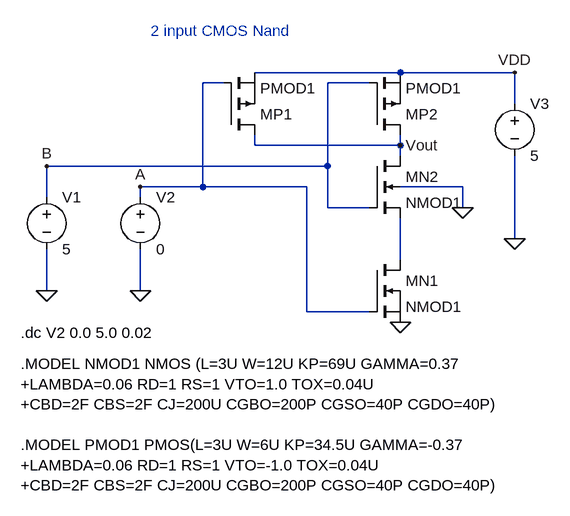
[diagram p0: schematic two_in_cmos_nand.asc]
two_in_cmos_nand.asc, the LTspice schematic file:
Version 4
SHEET 1 880 680
WIRE 416 -96 192 -96
WIRE 592 -96 416 -96
WIRE 144 -80 112 -80
WIRE 368 -80 304 -80
WIRE 592 -48 592 -96
WIRE 192 16 192 0
WIRE 416 16 416 0
WIRE 416 16 192 16
WIRE 416 32 416 16
WIRE 304 48 304 -80
WIRE 304 48 -128 48
WIRE 112 80 112 -80
WIRE 112 80 16 80
WIRE 272 80 112 80
WIRE 512 80 416 80
WIRE -128 96 -128 48
WIRE 16 96 16 80
WIRE 304 112 304 48
WIRE 368 112 304 112
WIRE 512 112 512 80
WIRE 592 160 592 32
WIRE 416 192 416 128
WIRE -128 240 -128 176
WIRE 16 240 16 176
WIRE 272 272 272 80
WIRE 368 272 272 272
FLAG -128 240 0
FLAG 16 240 0
FLAG 416 288 0
FLAG 592 160 0
FLAG 512 112 0
FLAG -128 48 B
FLAG 16 80 A
FLAG 592 -96 VDD
FLAG 416 16 Vout
SYMBOL voltage -128 80 R0
SYMATTR InstName V1
SYMATTR Value 5
SYMBOL voltage 16 80 R0
SYMATTR InstName V2
SYMATTR Value 0
SYMBOL voltage 592 -64 R0
SYMATTR InstName V3
SYMATTR Value 5
SYMBOL nmos 368 192 R0
SYMATTR InstName MN1
SYMATTR Value NMOD1
SYMBOL nmos4 368 32 R0
SYMATTR InstName MN2
SYMATTR Value NMOD1
SYMBOL pmos 368 0 M180
SYMATTR InstName MP2
SYMATTR Value PMOD1
SYMBOL pmos 144 0 M180
SYMATTR InstName MP1
SYMATTR Value PMOD1
TEXT 32 -160 Left 2 ;2 input CMOS Nand
TEXT -168 352 Left 2 !.MODEL NMOD1 NMOS (L=3U W=12U KP=69U GAMMA=0.37\n+LAMBDA=0.06 RD=1 RS=1 VTO=1.0 TOX=0.04U\n+CBD=2F CBS=2F CJ=200U CGBO=200P CGSO=40P CGDO=40P)\n \n.MODEL PMOD1 PMOS(L=3U W=6U KP=34.5U GAMMA=-0.37\n+LAMBDA=0.06 RD=1 RS=1 VTO=-1.0 TOX=0.04U\n+CBD=2F CBS=2F CJ=200U CGBO=200P CGSO=40P CGDO=40P)
TEXT -168 304 Left 2 !.dc V2 0.0 5.0 0.02

The netlist it stands for:
* two_in_cmos_nand.asc
V1 B 0 5
V2 A 0 0
V3 VDD 0 5
MN1 N001 A 0 0 NMOD1
MN2 Vout B N001 0 NMOD1
MP2 Vout B VDD VDD PMOD1
MP1 Vout A VDD VDD PMOD1
.model NMOS NMOS
.model PMOS PMOS
.lib standard.mos
* 2 input CMOS Nand
.MODEL NMOD1 NMOS (L=3U W=12U KP=69U GAMMA=0.37
+LAMBDA=0.06 RD=1 RS=1 VTO=1.0 TOX=0.04U
+CBD=2F CBS=2F CJ=200U CGBO=200P CGSO=40P CGDO=40P)
.MODEL PMOD1 PMOS(L=3U W=6U KP=34.5U GAMMA=-0.37
+LAMBDA=0.06 RD=1 RS=1 VTO=-1.0 TOX=0.04U
+CBD=2F CBS=2F CJ=200U CGBO=200P CGSO=40P CGDO=40P)
.dc V2 0.0 5.0 0.02
.backanno
.end

* Results of the author's LTspice run, read from the files saved beside the schematic
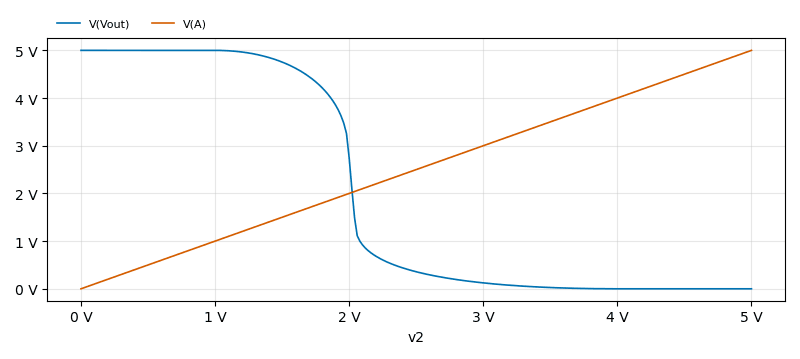
[diagram p1: DC transfer characteristic of two_in_cmos_nand.asc, plotted from the saved traces]
* DC transfer characteristic, 1 run:
*   V(Vout): 5 V at v2=0 V, 36.35 nV at v2=5 V, min 36.35 nV, max 5 V
*   V(A): 0 V at v2=0 V, 5 V at v2=5 V, min 0 V, max 5 V